# Altium schematic sheet JTAG.SchDoc
size A; SheetNumber: 5; SheetTotal: 12
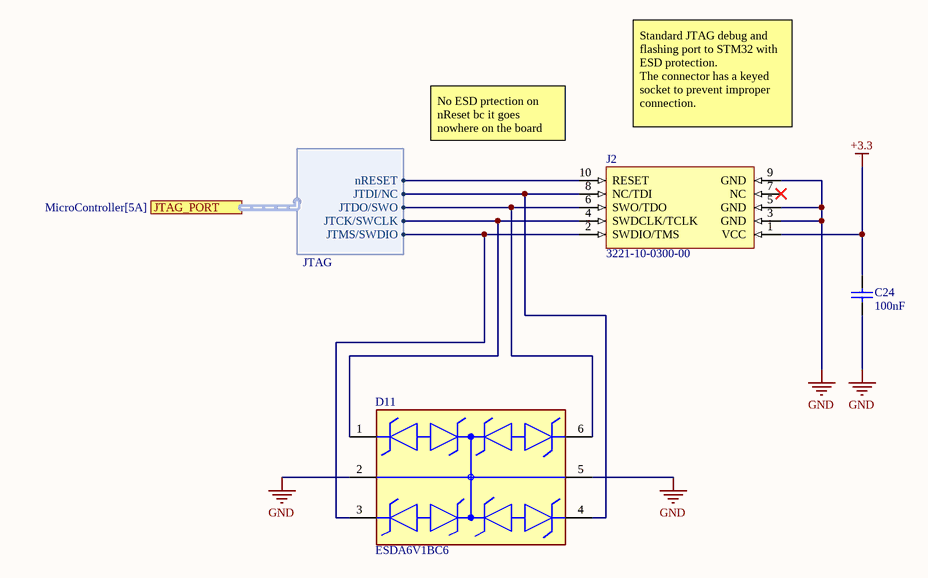
[diagram p0: JTAG.SchDoc]

## Parts
C24  value 100nF  [CAPC1608X90X40ML10T20]  (hidden comment: Capacitor 0.1uF +/-10% 50 V 0603)
D11  ESDA6V1BC6  [FP-SOT23-6L-IPC_A]
J2  3221-10-0300-00  [3221-10-0300-00-Footprint-1]

## Ports
JTAG_PORT (harness JTAG, see MicroController[5A])

## Harnesses
JTAG: JTMS/SWDIO, JTCK/SWCLK, JTDO/SWO, JTDI/NC, nRESET

## Nets
+3.3: C24.2 J2.1(VCC)
GND: C24.1 D11.2 D11.5 J2.3(GND) J2.5(GND) J2.9(GND)
NetD11_1: D11.1 J2.4(SWDCLK/TCLK) ; port JTAG_PORT.JTCK/SWCLK
NetD11_3: D11.3 J2.2(SWDIO/TMS) ; port JTAG_PORT.JTMS/SWDIO
NetD11_4: D11.4 J2.8(NC/TDI) ; port JTAG_PORT.JTDI/NC
NetD11_6: D11.6 J2.6(SWO/TDO) ; port JTAG_PORT.JTDO/SWO
NetJ2_10: J2.10(RESET) ; port JTAG_PORT.nRESET

Not connected (* = marked no-connect by the designer): J2 7(NC)*

## Notes on the sheet
- Standard JTAG debug and flashing port to STM32 with ESD protection.
  The connector has a keyed socket to prevent improper connection.
- No ESD prtection on nReset bc it goes nowhere on the board

## Library data of the parts
C24 = CMP-001-00017-10: Chip Capacitor, 0.1uF, +/- 10%, 50 V, 0603 (1608 Metric); Capacitor Type: Ceramic; Voltage Rating: 50V; Min Operating Temperature: -55°C; Max Operating Temperature: 125°C; Mounting Technology: SMT; Tolerance: 10%; Pins: 2; Case/Package: 0603
D11 = CMP-004-00048-1: Trans Voltage Suppressor Diode, 80W, 5V V(RWM), Bidirectional, 4 Element, Silicon; Max Surge Current: 8A; Peak Inverse Voltage: 8V; Max Operating Temperature: 150°C; Pins: 6; Mounting Technology: SMD; RoHS Compliant: Yes; Case/Package: SOT23-6L
J2 = CMP-002-00077-1: JTAG STLINK CONN HEADER SMD 10POS 1.27MM